# Altium project PCB_Project.PrjPcb
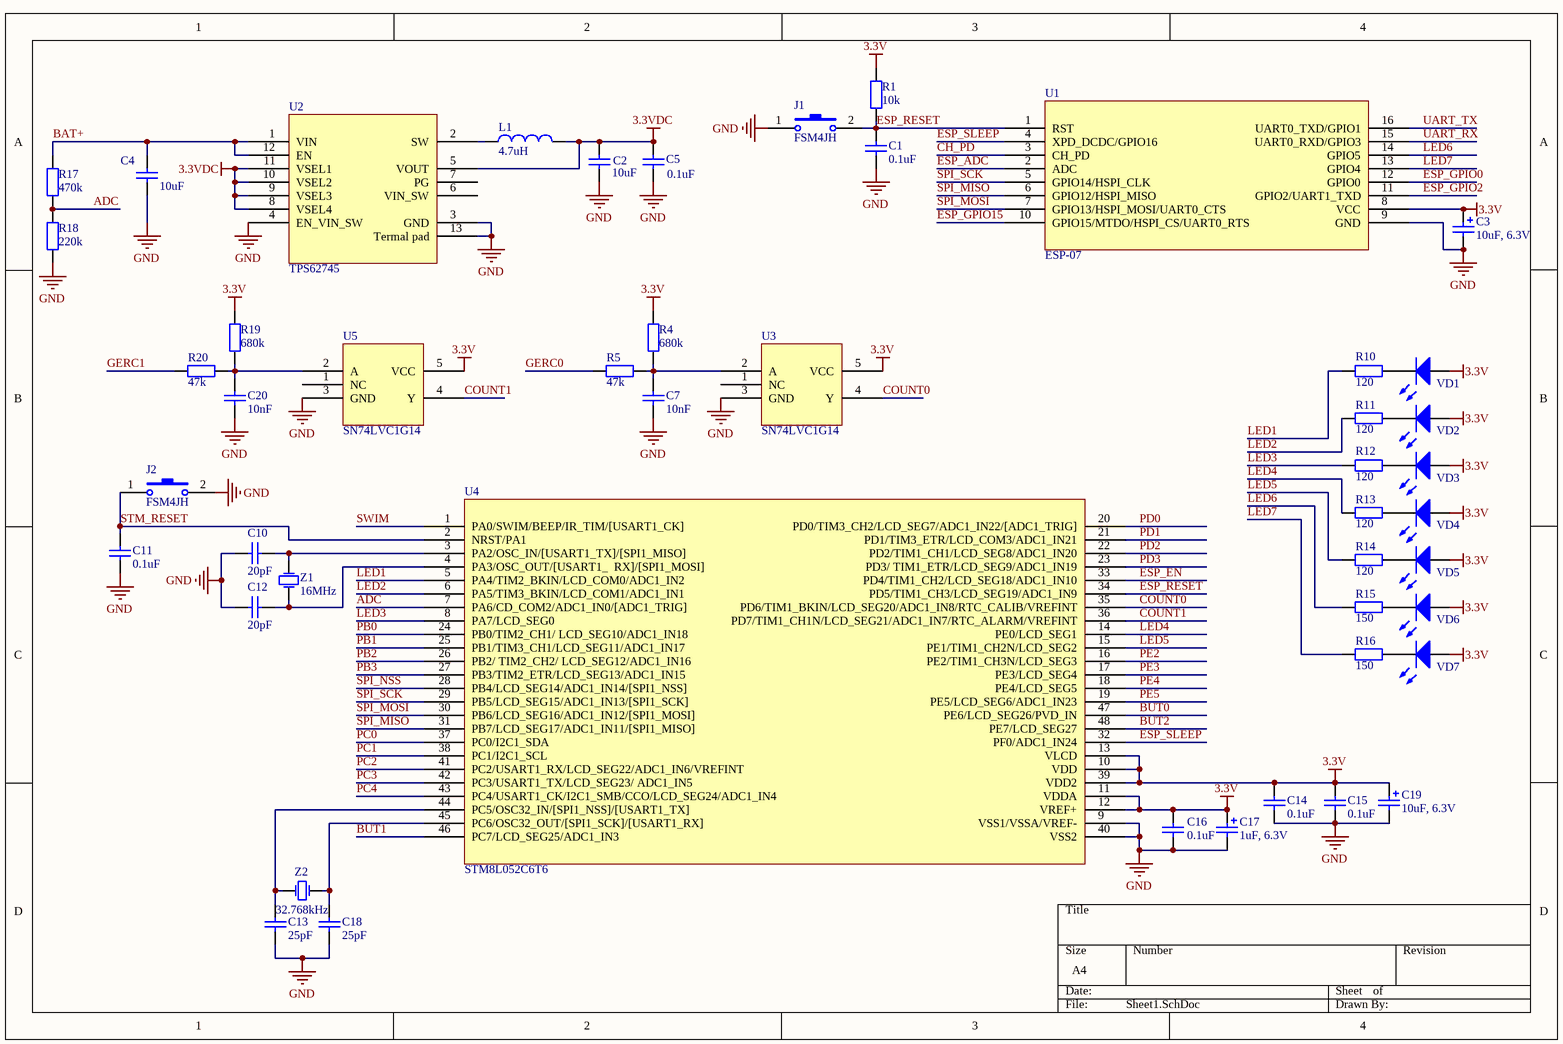
[diagram p0: Sheet1.SchDoc]
2 sheets, 74 parts. Net scope: global (net labels, ports and power ports of the same name join across sheets).
Board file: PCB1.PcbDoc
Sheets:
  Sheet1.SchDoc
  Sheet2.SchDoc

## Sheet Sheet1.SchDoc
size A4

### Parts
C1  value 0.1uF  [0603(CAPC1608X09N)]  (hidden comment: Capacitor)
C2  value 10uF  [1206(CAPC3216X15N)]  (hidden comment: Capacitor)
C3  value 10uF, 6.3V  [1206(typeA)]  (hidden comment: Capacitor Polarized)
C4  value 10uF  [1206(CAPC3216X15N)]  (hidden comment: Capacitor)
C5  value 0.1uF  [0603(CAPC1608X09N)]  (hidden comment: Capacitor)
C7  value 10nF  [0603(CAPC1608X09N)]  (hidden comment: Capacitor)
C10  value 20pF  [0603(CAPC1608X09N)]  (hidden comment: Capacitor)
C11  value 0.1uF  [0603(CAPC1608X09N)]  (hidden comment: Capacitor)
C12  value 20pF  [0603(CAPC1608X09N)]  (hidden comment: Capacitor)
C13  value 25pF  [0603(CAPC1608X09N)]  (hidden comment: Capacitor)
C14  value 0.1uF  [0603(CAPC1608X09N)]  (hidden comment: Capacitor)
C15  value 0.1uF  [0603(CAPC1608X09N)]  (hidden comment: Capacitor)
C16  value 0.1uF  [0603(CAPC1608X09N)]  (hidden comment: Capacitor)
C17  value 1uF, 6.3V  [1206(typeA)]  (hidden comment: Capacitor Polarized)
C18  value 25pF  [0603(CAPC1608X09N)]  (hidden comment: Capacitor)
C19  value 10uF, 6.3V  [1206(typeA)]  (hidden comment: Capacitor Polarized)
C20  value 10nF  [0603(CAPC1608X09N)]  (hidden comment: Capacitor)
J1  FSM4JH  [FSM4JH]
J2  FSM4JH  [FSM4JH]
L1  value 4.7uH  [0806 (2016)]  (hidden comment: Inductor)
R1  value 10k  [0603(RESC1608X05N)]  (hidden comment: Resistor)
R4  value 680k  [0603(RESC1608X05N)]  (hidden comment: Resistor)
R5  value 47k  [0603(RESC1608X05N)]  (hidden comment: Resistor)
R10  value 120  [0603(RESC1608X05N)]  (hidden comment: Resistor)
R11  value 120  [0603(RESC1608X05N)]  (hidden comment: Resistor)
R12  value 120  [0603(RESC1608X05N)]  (hidden comment: Resistor)
R13  value 120  [0603(RESC1608X05N)]  (hidden comment: Resistor)
R14  value 120  [0603(RESC1608X05N)]  (hidden comment: Resistor)
R15  value 150  [0603(RESC1608X05N)]  (hidden comment: Resistor)
R16  value 150  [0603(RESC1608X05N)]  (hidden comment: Resistor)
R17  value 470k  [0603(RESC1608X05N)]  (hidden comment: Resistor)
R18  value 220k  [0603(RESC1608X05N)]  (hidden comment: Resistor)
R19  value 680k  [0603(RESC1608X05N)]  (hidden comment: Resistor)
R20  value 47k  [0603(RESC1608X05N)]  (hidden comment: Resistor)
U1  ESP-07  [ESP-07]
U2  TPS62745  [12-WSON (3x2)]
U3  SN74LVC1G14  [SOT23-5]
U4  STM8L052C6T6  [LQFP-48]
U5  SN74LVC1G14  [SOT23-5]
VD1  Led  [GNL-3014xx]  (value not drawn)
VD2  Led  [GNL-3014xx]  (value not drawn)
VD3  Led  [GNL-3014xx]  (value not drawn)
VD4  Led  [GNL-3014xx]  (value not drawn)
VD5  Led  [GNL-3014xx]  (value not drawn)
VD6  Led  [GNL-3014xx]  (value not drawn)
VD7  Led  [GNL-3014xx]  (value not drawn)
Z1  value 16MHz  [HC49S]  (hidden comment: Crystal Oscillator)
Z2  value 32.768kHz  [KX–327NHT]  (hidden comment: Crystal Oscillator)

### Nets
3.3V: C3.1 C14.2 C15.2 C16.1 C17.1 C19.1 R1.2 R4.2 R19.2 U1.8(VCC) U3.5(VCC) U4.10(VDD) U4.11(VDDA) U4.12(VREF+) U4.13(VLCD) U4.39(VDD2) U5.5(VCC) VD1.1(A) VD2.1(A) VD3.1(A) VD4.1(A) VD5.1(A) VD6.1(A) VD7.1(A)
3.3VDC: C2.2 C5.2 L1.1 U2.5(VOUT) U2.8(VSEL4) U2.9(VSEL3) U2.10(VSEL2) U2.11(VSEL1)
GND: C1.1 C2.1 C3.2 C4.2 C5.1 C7.1 C10.1 C11.1 C12.1 C13.1 C14.1 C15.1 C16.2 C17.2 C18.1 C19.2 C20.1 J1.1(COMMON1) J2.2(NO1) R18.1 U1.9(GND) U2.3(GND) U2.4(EN_VIN_SW) U2.13(Termal_pad) U3.3(GND) U4.9(VSS1/VSSA/VREF-) U4.40(VSS2) U5.3(GND)
ADC: R17.1 R18.2 U4.7(PA6/CD_COM2/ADC1_IN0/[ADC1_TRIG])
BAT+: C4.1 R17.2 U2.1(VIN) U2.12(EN)
BUT0: U4.47(PE6/LCD_SEG26/PVD_IN)
BUT1: U4.46(PC7/LCD_SEG25/ADC1_IN3)
BUT2: U4.48(PE7/LCD_SEG27)
CH_PD: U1.3(CH_PD)
COUNT0: U3.4(Y) U4.35(PD6/TIM1_BKIN/LCD_SEG20/ADC1_IN8/RTC_CALIB/VREFINT)
COUNT1: U4.36(PD7/TIM1_CH1N/LCD_SEG21/ADC1_IN7/RTC_ALARM/VREFINT) U5.4(Y)
ESP_ADC: U1.2(ADC)
ESP_EN: U4.33(PD4/TIM1_CH2/LCD_SEG18/ADC1_IN10)
ESP_GPIO0: U1.12(GPIO0)
ESP_GPIO2: U1.11(GPIO2/UART1_TXD)
ESP_GPIO15: U1.10(GPIO15/MTDO/HSPI_CS/UART0_RTS)
ESP_RESET: C1.2 J1.2(NO1) R1.1 U1.1(RST) U4.34(PD5/TIM1_CH3/LCD_SEG19/ADC1_IN9)
ESP_SLEEP: U1.4(XPD_DCDC/GPIO16) U4.32(PF0/ADC1_IN24)
GERC0: R5.2
GERC1: R20.2
LED1: R10.1 U4.5(PA4/TIM2_BKIN/LCD_COM0/ADC1_IN2)
LED2: R11.1 U4.6(PA5/TIM3_BKIN/LCD_COM1/ADC1_IN1)
LED3: R12.1 U4.8(PA7/LCD_SEG0)
LED4: R13.1 U4.14(PE0/LCD_SEG1)
LED5: R14.1 U4.15(PE1/TIM1_CH2N/LCD_SEG2)
LED6: R15.1 U1.14(GPIO5)
LED7: R16.1 U1.13(GPIO4)
PB0: U4.24(PB0/TIM2_CH1/_LCD_SEG10/ADC1_IN18)
PB1: U4.25(PB1/TIM3_CH1/LCD_SEG11/ADC1_IN17)
PB2: U4.26(PB2/_TIM2_CH2/_LCD_SEG12/ADC1_IN16)
PB3: U4.27(PB3/TIM2_ETR/LCD_SEG13/ADC1_IN15)
PC0: U4.37(PC0/I2C1_SDA)
PC1: U4.38(PC1/I2C1_SCL)
PC2: U4.41(PC2/USART1_RX/LCD_SEG22/ADC1_IN6/VREFINT)
PC3: U4.42(PC3/USART1_TX/LCD_SEG23/_ADC1_IN5)
PC4: U4.43(PC4/USART1_CK/I2C1_SMB/CCO/LCD_SEG24/ADC1_IN4)
PD0: U4.20(PD0/TIM3_CH2/LCD_SEG7/ADC1_IN22/[ADC1_TRIG])
PD1: U4.21(PD1/TIM3_ETR/LCD_COM3/ADC1_IN21)
PD2: U4.22(PD2/TIM1_CH1/LCD_SEG8/ADC1_IN20)
PD3: U4.23(PD3/_TIM1_ETR/LCD_SEG9/ADC1_IN19)
PE2: U4.16(PE2/TIM1_CH3N/LCD_SEG3)
PE3: U4.17(PE3/LCD_SEG4)
PE4: U4.18(PE4/LCD_SEG5)
PE5: U4.19(PE5/LCD_SEG6/ADC1_IN23)
SPI_MISO: U1.6(GPIO12/HSPI_MISO) U4.31(PB7/LCD_SEG17/ADC1_IN11/[SPI1_MISO])
SPI_MOSI: U1.7(GPIO13/HSPI_MOSI/UART0_CTS) U4.30(PB6/LCD_SEG16/ADC1_IN12/[SPI1_MOSI])
SPI_NSS: U4.28(PB4/LCD_SEG14/ADC1_IN14/[SPI1_NSS])
SPI_SCK: U1.5(GPIO14/HSPI_CLK) U4.29(PB5/LCD_SEG15/ADC1_IN13/[SPI1_SCK])
STM_RESET: C11.2 J2.1(COMMON1) U4.2(NRST/PA1)
SWIM: U4.1(PA0/SWIM/BEEP/IR_TIM/[USART1_CK])
UART_RX: U1.15(UART0_RXD/GPIO3)
UART_TX: U1.16(UART0_TXD/GPIO1)
NetC7_2: C7.2 R4.1 R5.1 U3.2(A)
NetC10_2: C10.2 U4.3(PA2/OSC_IN/[USART1_TX]/[SPI1_MISO]) Z1.2(OSC2)
NetC12_2: C12.2 U4.4(PA3/OSC_OUT/[USART1___RX]/[SPI1_MOSI]) Z1.1(OSC1)
NetC13_2: C13.2 U4.44(PC5/OSC32_IN/[SPI1_NSS]/[USART1_TX]) Z2.2(OSC2)
NetC18_2: C18.2 U4.45(PC6/OSC32_OUT/[SPI1_SCK]/[USART1_RX]) Z2.1(OSC1)
NetC20_2: C20.2 R19.1 R20.1 U5.2(A)
NetL1_2: L1.2 U2.2(SW)
NetR10_2: R10.2 VD1.2(K)
NetR11_2: R11.2 VD2.2(K)
NetR12_2: R12.2 VD3.2(K)
NetR13_2: R13.2 VD4.2(K)
NetR14_2: R14.2 VD5.2(K)
NetR15_2: R15.2 VD6.2(K)
NetR16_2: R16.2 VD7.2(K)

Not connected (* = marked no-connect by the designer): U2 6(VIN_SW) 7(PG); U3 1(NC); U5 1(NC)

### Library data of the parts
C1 C2 C4 C5 C7 C10-C16 C18 C20 = Capacitor: Name: Конденсатор керамический SMD
C3 C17 C19 = Polarized Capacitor: Name: Конденсатор электролитический танталовый SMD
J1 J2 = Tact switch: Model: FSM4JH
L1 = Inductor: Name: Индуктивность SMD; Model: DFE201612E
R1 R4 R5 R10-R20 = Resistor: Name: Резистор SMD
U1 = ESP-07: WiFi module; Model: ESP-07
U2 = TPS62745: DC/DC step down; Part number: TPS62745DSST; Manufacturer: Texas Instruments; Datasheet: http://www.ti.com/lit/ds/symlink/tps62745.pdf; Model: TPS62745; Package: 12-WSON (3x2)
U3 U5 = SN74LVC1G14: Single SchmittT-Trigger Inverter; Part number: SN74LVC1G14DBVR; Manufacturer: Texas Instruments; Package: SOT-23-5; Datasheet: http://www.ti.com/lit/ds/symlink/sn74lvc1g14.pdf; Model: SN74LVC1G14
U4 = STM8L052C6: MCU; Manufacturer: STMicroelectronics; Model: STM8L052C6T6; Part number: STM8L052C6T6; Datasheet: https://www.st.com/content/ccc/resource/technical/document/datasheet/05/b6/38/25/7d/c5/4b/cd/DM00057687.pdf/files/DM00057687.pdf/jcr:content/translations/en.DM00057687.pdf; Package: 48-LQFP (7x7)
VD1-VD7 = Led: Светодиод; Name: Светодиод 1206 зеленый
Z1 Z2 = Crystal: Name: Кварцевый резонатор

## Sheet Sheet2.SchDoc
size A4
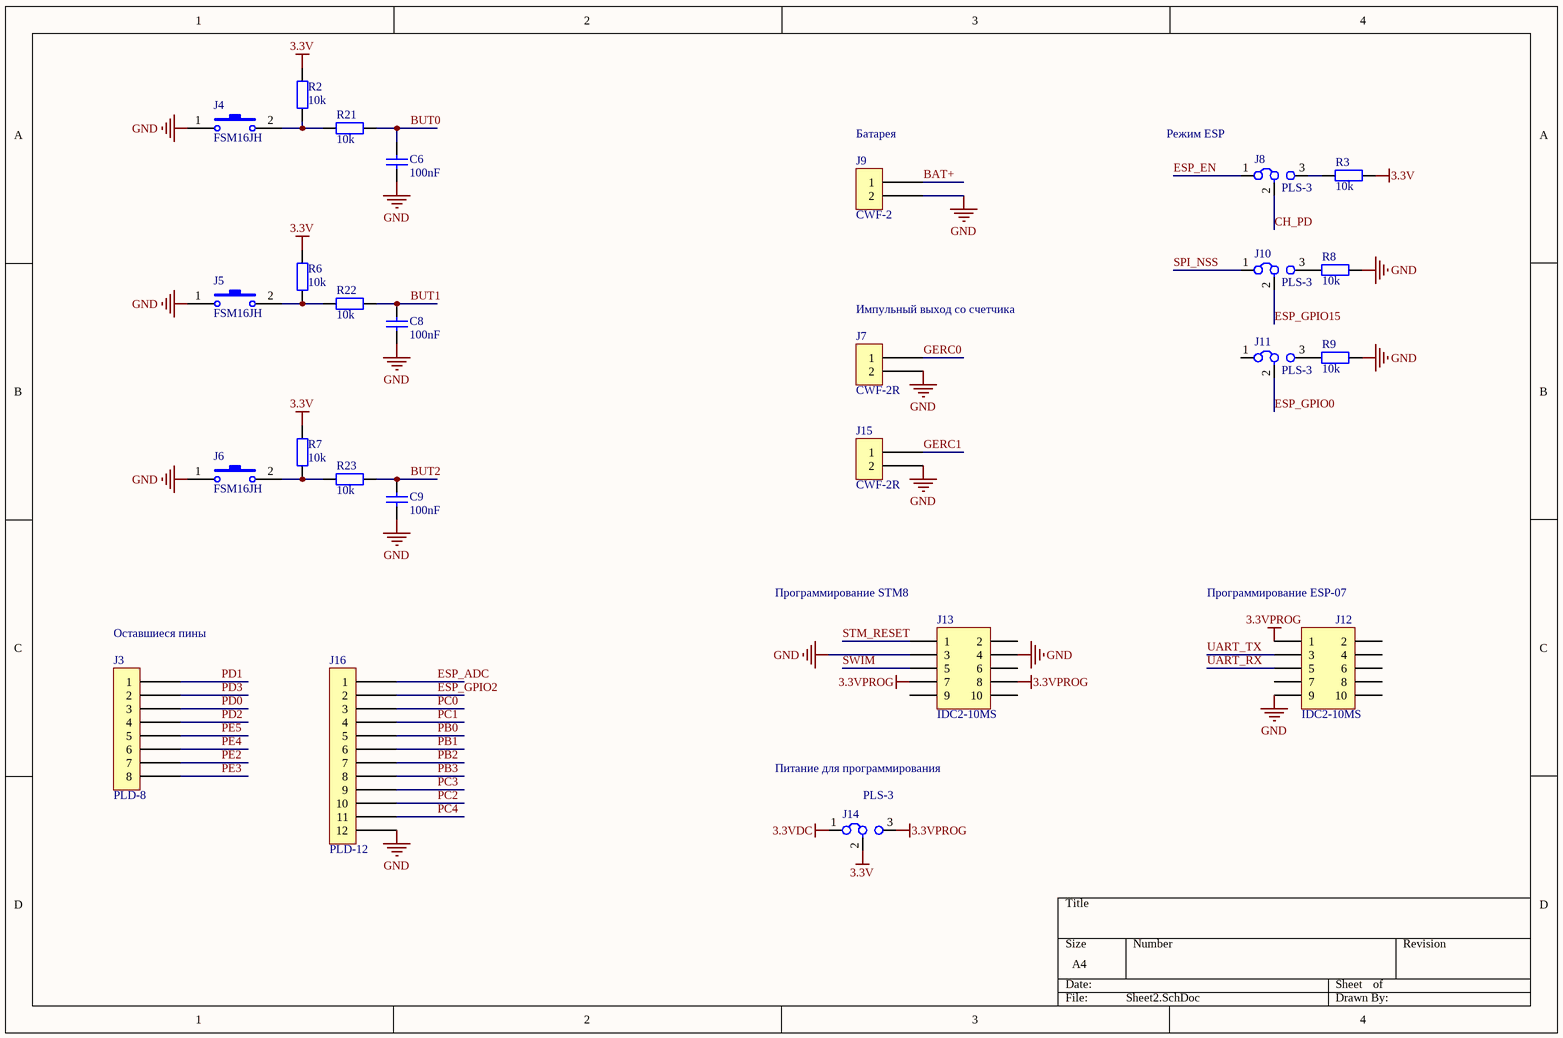
[diagram p1: Sheet2.SchDoc]

### Parts
C6  value 100nF  [0603(CAPC1608X09N)]  (hidden comment: Capacitor)
C8  value 100nF  [0603(CAPC1608X09N)]  (hidden comment: Capacitor)
C9  value 100nF  [0603(CAPC1608X09N)]  (hidden comment: Capacitor)
J3  PLD-8  [PLD-8]
J4  FSM16JH  [FSM16JH]
J5  FSM16JH  [FSM16JH]
J6  FSM16JH  [FSM16JH]
J7  CWF-2R  [DS1069-2MRW6XB]
J8  PLS-3  [PLS-3]
J9  CWF-2  [DS1069-2MVW6X]
J10  PLS-3  [PLS-3]
J11  PLS-3  [PLS-3]
J12  IDC2-10MS  [IDC2-10MS]
J13  IDC2-10MS  [IDC2-10MS]
J14  PLS-3  [PLS-3]
J15  CWF-2R  [DS1069-2MRW6XB]
J16  PLD-12  [PLD-12]
R2  value 10k  [0603(RESC1608X05N)]  (hidden comment: Resistor)
R3  value 10k  [0603(RESC1608X05N)]  (hidden comment: Resistor)
R6  value 10k  [0603(RESC1608X05N)]  (hidden comment: Resistor)
R7  value 10k  [0603(RESC1608X05N)]  (hidden comment: Resistor)
R8  value 10k  [0603(RESC1608X05N)]  (hidden comment: Resistor)
R9  value 10k  [0603(RESC1608X05N)]  (hidden comment: Resistor)
R21  value 10k  [0603(RESC1608X05N)]  (hidden comment: Resistor)
R22  value 10k  [0603(RESC1608X05N)]  (hidden comment: Resistor)
R23  value 10k  [0603(RESC1608X05N)]  (hidden comment: Resistor)

### Nets
3.3V: J14.2 R2.2 R3.2 R6.2 R7.2
3.3VDC: J14.1
3.3VPROG: J12.1 J13.7 J13.8 J14.3
GND: C6.1 C8.1 C9.1 J4.1(COMMON1) J5.1(COMMON1) J6.1(COMMON1) J7.2 J9.2 J12.9 J13.3 J13.4 J15.2 J16.12 R8.2 R9.2
BAT+: J9.1
BUT0: C6.2 R21.2
BUT1: C8.2 R22.2
BUT2: C9.2 R23.2
CH_PD: J8.2
ESP_ADC: J16.1
ESP_EN: J8.1
ESP_GPIO0: J11.2
ESP_GPIO2: J16.2
ESP_GPIO15: J10.2
GERC0: J7.1
GERC1: J15.1
PB0: J16.5
PB1: J16.6
PB2: J16.7
PB3: J16.8
PC0: J16.3
PC1: J16.4
PC2: J16.10
PC3: J16.9
PC4: J16.11
PD0: J3.3
PD1: J3.1
PD2: J3.4
PD3: J3.2
PE2: J3.7
PE3: J3.8
PE4: J3.6
PE5: J3.5
SPI_NSS: J10.1
STM_RESET: J13.1
SWIM: J13.5
UART_RX: J12.5
UART_TX: J12.3
NetJ4_2: J4.2(NO1) R2.1 R21.1
NetJ5_2: J5.2(NO1) R6.1 R22.1
NetJ6_2: J6.2(NO1) R7.1 R23.1
NetJ8_3: J8.3 R3.1
NetJ10_3: J10.3 R8.1
NetJ11_3: J11.3 R9.1

Not connected (* = marked no-connect by the designer): J11 1; J12 2 4 6 7 8 10; J13 2 6 9 10

### Notes on the sheet
- (near J9) Батарея
- (near J8) Режим ESP
- (near J7) Импульный выход со счетчика
- (near J3) Оставшиеся пины
- (near J13) Программирование STM8
- (near J12) Программирование ESP-07
- Питание для программирования

### Library data of the parts
C6 C8 C9 = Capacitor: Name: Конденсатор керамический SMD
J3 = PLD-8: Вилка штыревая PLD-8, прямая; Manufacturer: Connfly; Model: PLD-8
J4-J6 = Tact switch: Model: FSM16JH
J7 J15 = CWF-2R: Вилка на плату CWF-2R, угловая; Manufacturer: Connfly; Model: DS1069-2MRW6XB; Part number: DS1069-2MRW6XB
J8 J10 J11 J14 = PLS-3: Вилка штыревая PLS-3, прямая; Name: Вилка штыревая PLS-3, прямая
J9 = CWF-2: Вилка на плату CWF-2, прямая; Manufacturer: Connfly; Model: DS1069-2MVW6X; Part number: DS1069-2MVW6X
J12 J13 = IDC2-10MS: Вилка на плату IDC2-10MS, прямая; Name: Вилка на плату IDC2-10MS, прямая
J16 = PLD-12: Вилка штыревая PLD-12, прямая; Manufacturer: Connfly; Model: PLD-12
R2 R3 R6-R9 R21-R23 = Resistor: Name: Резистор SMD

## Nets that join several sheets
3.3V: Sheet1 (24 pins), Sheet2 (5 pins)
3.3VDC: Sheet1 (8 pins), Sheet2 (J14.1)
GND: Sheet1 (28 pins), Sheet2 (15 pins)
BAT+: Sheet1 (C4.1 R17.2 U2.1 U2.12), Sheet2 (J9.1)
BUT0: Sheet1 (U4.47), Sheet2 (C6.2 R21.2)
BUT1: Sheet1 (U4.46), Sheet2 (C8.2 R22.2)
BUT2: Sheet1 (U4.48), Sheet2 (C9.2 R23.2)
CH_PD: Sheet1 (U1.3), Sheet2 (J8.2)
ESP_ADC: Sheet1 (U1.2), Sheet2 (J16.1)
ESP_EN: Sheet1 (U4.33), Sheet2 (J8.1)
ESP_GPIO0: Sheet1 (U1.12), Sheet2 (J11.2)
ESP_GPIO2: Sheet1 (U1.11), Sheet2 (J16.2)
ESP_GPIO15: Sheet1 (U1.10), Sheet2 (J10.2)
GERC0: Sheet1 (R5.2), Sheet2 (J7.1)
GERC1: Sheet1 (R20.2), Sheet2 (J15.1)
PB0: Sheet1 (U4.24), Sheet2 (J16.5)
PB1: Sheet1 (U4.25), Sheet2 (J16.6)
PB2: Sheet1 (U4.26), Sheet2 (J16.7)
PB3: Sheet1 (U4.27), Sheet2 (J16.8)
PC0: Sheet1 (U4.37), Sheet2 (J16.3)
PC1: Sheet1 (U4.38), Sheet2 (J16.4)
PC2: Sheet1 (U4.41), Sheet2 (J16.10)
PC3: Sheet1 (U4.42), Sheet2 (J16.9)
PC4: Sheet1 (U4.43), Sheet2 (J16.11)
PD0: Sheet1 (U4.20), Sheet2 (J3.3)
PD1: Sheet1 (U4.21), Sheet2 (J3.1)
PD2: Sheet1 (U4.22), Sheet2 (J3.4)
PD3: Sheet1 (U4.23), Sheet2 (J3.2)
PE2: Sheet1 (U4.16), Sheet2 (J3.7)
PE3: Sheet1 (U4.17), Sheet2 (J3.8)
PE4: Sheet1 (U4.18), Sheet2 (J3.6)
PE5: Sheet1 (U4.19), Sheet2 (J3.5)
SPI_NSS: Sheet1 (U4.28), Sheet2 (J10.1)
STM_RESET: Sheet1 (C11.2 J2.1 U4.2), Sheet2 (J13.1)
SWIM: Sheet1 (U4.1), Sheet2 (J13.5)
UART_RX: Sheet1 (U1.15), Sheet2 (J12.5)
UART_TX: Sheet1 (U1.16), Sheet2 (J12.3)